# EAGLE design Display (EAGLE 9.6.2)
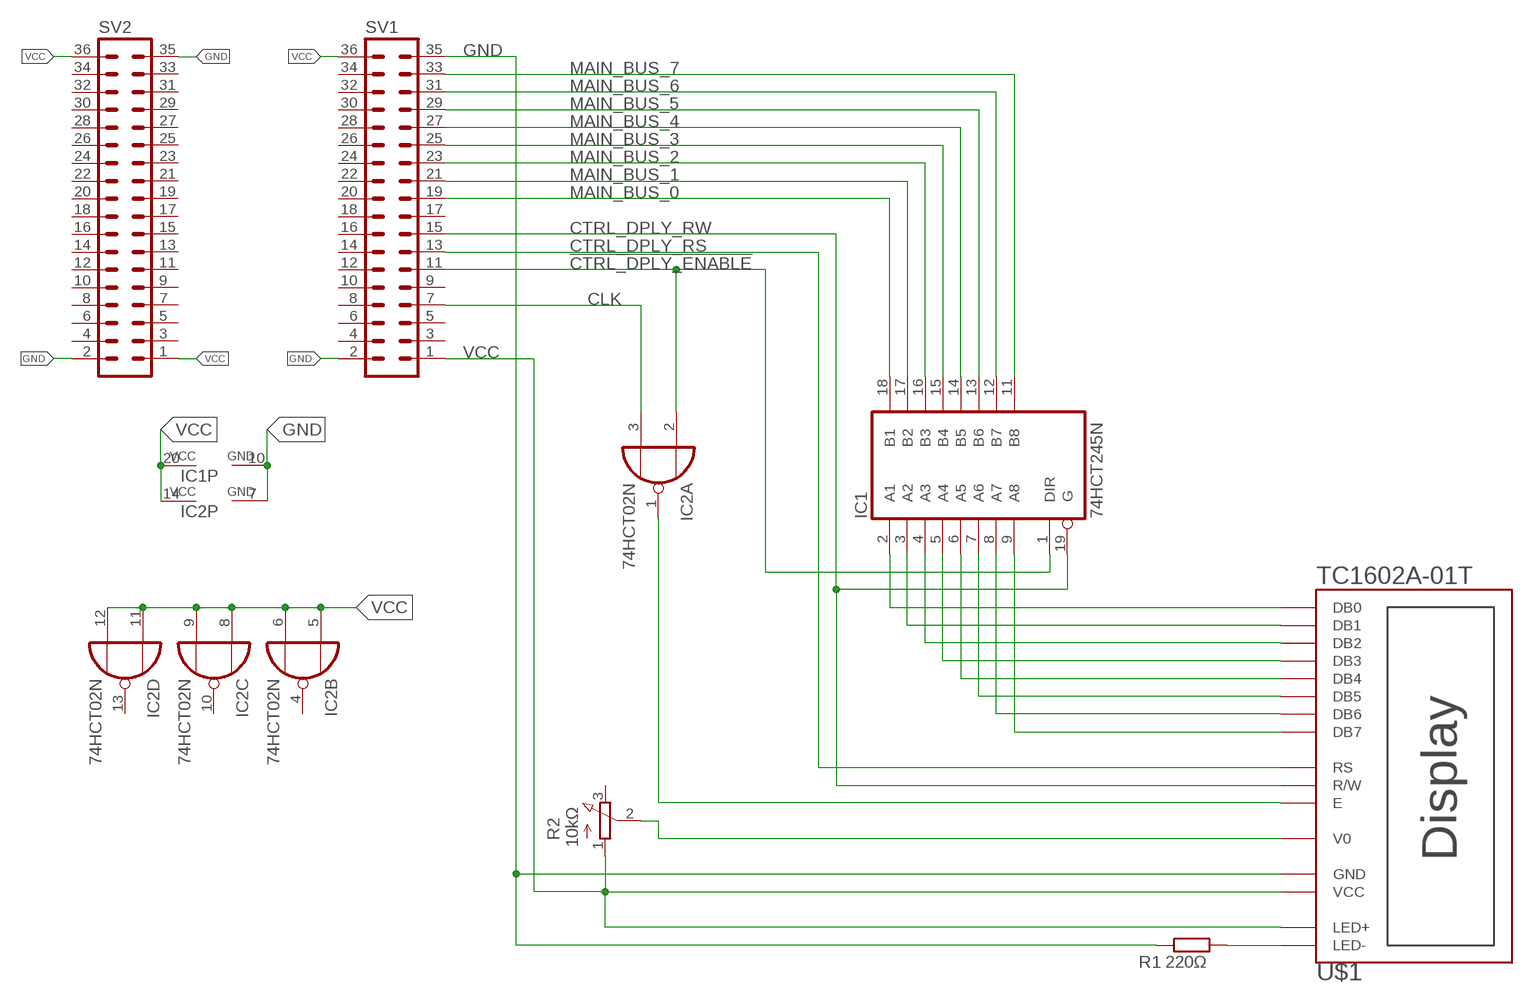
[diagram p0: schematic, sheet 1]

## Parts
IC1  74HCT245N  [DIL20]
IC2  74HCT02N  [DIL14]
R1  220Ω  R-EU_0207/10  [0207/10]
R2  10kΩ  3RP/1610N  [3RP/1610N]
SV1  MA18-2  [MA18-2]
SV2  MA18-2  [MA18-2]
U$1  TC1602A-01T  [TC1602A-01T]

## Nets
!CTRL_DPLY_ENABLE: IC1.1(DIR) IC2.2(A:I0) SV1.11
CLK: IC2.3(A:I1) SV1.7
CTRL_DPLY_RS: SV1.13 U$1.RS
CTRL_DPLY_RW: IC1.19(G) SV1.15 U$1.R/W
GND: IC1.10(GND) IC2.7(P:GND) R1.1 SV1.2 SV1.35 SV2.2 SV2.35 U$1.GND
MAIN_BUS_0: IC1.18(B1) SV1.19
MAIN_BUS_1: IC1.17(B2) SV1.21
MAIN_BUS_2: IC1.16(B3) SV1.23
MAIN_BUS_3: IC1.15(B4) SV1.25
MAIN_BUS_4: IC1.14(B5) SV1.27
MAIN_BUS_5: IC1.13(B6) SV1.29
MAIN_BUS_6: IC1.12(B7) SV1.31
MAIN_BUS_7: IC1.11(B8) SV1.33
N$1: R1.2 U$1.LED-
N$2: R2.2(S) U$1.V0
N$10: IC1.9(A8) U$1.DB7
N$11: IC1.8(A7) U$1.DB6
N$12: IC1.7(A6) U$1.DB5
N$13: IC1.6(A5) U$1.DB4
N$14: IC1.5(A4) U$1.DB3
N$15: IC1.4(A3) U$1.DB2
N$16: IC1.3(A2) U$1.DB1
N$17: IC1.2(A1) U$1.DB0
N$21: IC2.1(A:O) U$1.E
VCC: IC1.20(VCC) IC2.5(B:I0) IC2.6(B:I1) IC2.8(C:I0) IC2.9(C:I1) IC2.11(D:I0) IC2.12(D:I1) IC2.14(P:VCC) R2.1(A) SV1.1 SV1.36 SV2.1 SV2.36 U$1.LED+ U$1.VCC
Unconnected: IC2.4(B:O) IC2.10(C:O) IC2.13(D:O) R2.3(E) SV1.3 SV1.4 SV1.5 SV1.6 SV1.8 SV1.9 SV1.10 SV1.12 SV1.14 SV1.16 SV1.17 SV1.18 SV1.20 SV1.22 SV1.24 SV1.26 SV1.28 SV1.30 SV1.32 SV1.34 SV2.3 SV2.4 SV2.5 SV2.6 SV2.7 SV2.8 SV2.9 SV2.10 SV2.11 SV2.12 SV2.13 SV2.14 SV2.15 SV2.16 SV2.17 SV2.18 SV2.19 SV2.20 SV2.21 SV2.22 SV2.23 SV2.24 SV2.25 SV2.26 SV2.27 SV2.28 SV2.29 SV2.30 SV2.31 SV2.32 SV2.33 SV2.34

## Library data of the parts
IC1 = 74xx-eu:74*245: Octal BUS TRANSCEIVER, 3-state
IC2 = 74xx-eu:74*02: Quad 2-input NOR gate
R1 = rcl:R-EU_: RESISTOR, European symbol; SPICEPREFIX: R
R2 = pot:3RP/1610N: 16mm Potentiometer one level Source: http://www.alphapotentiometers.net/html/16mm_pot_2.html
SV1 SV2 = con-lstb:MA18-2: PIN HEADER; OC_FARNELL: unknown; OC_NEWARK: unknown
U$1 = Dargon's_lib:TC1602A-01T

## Board
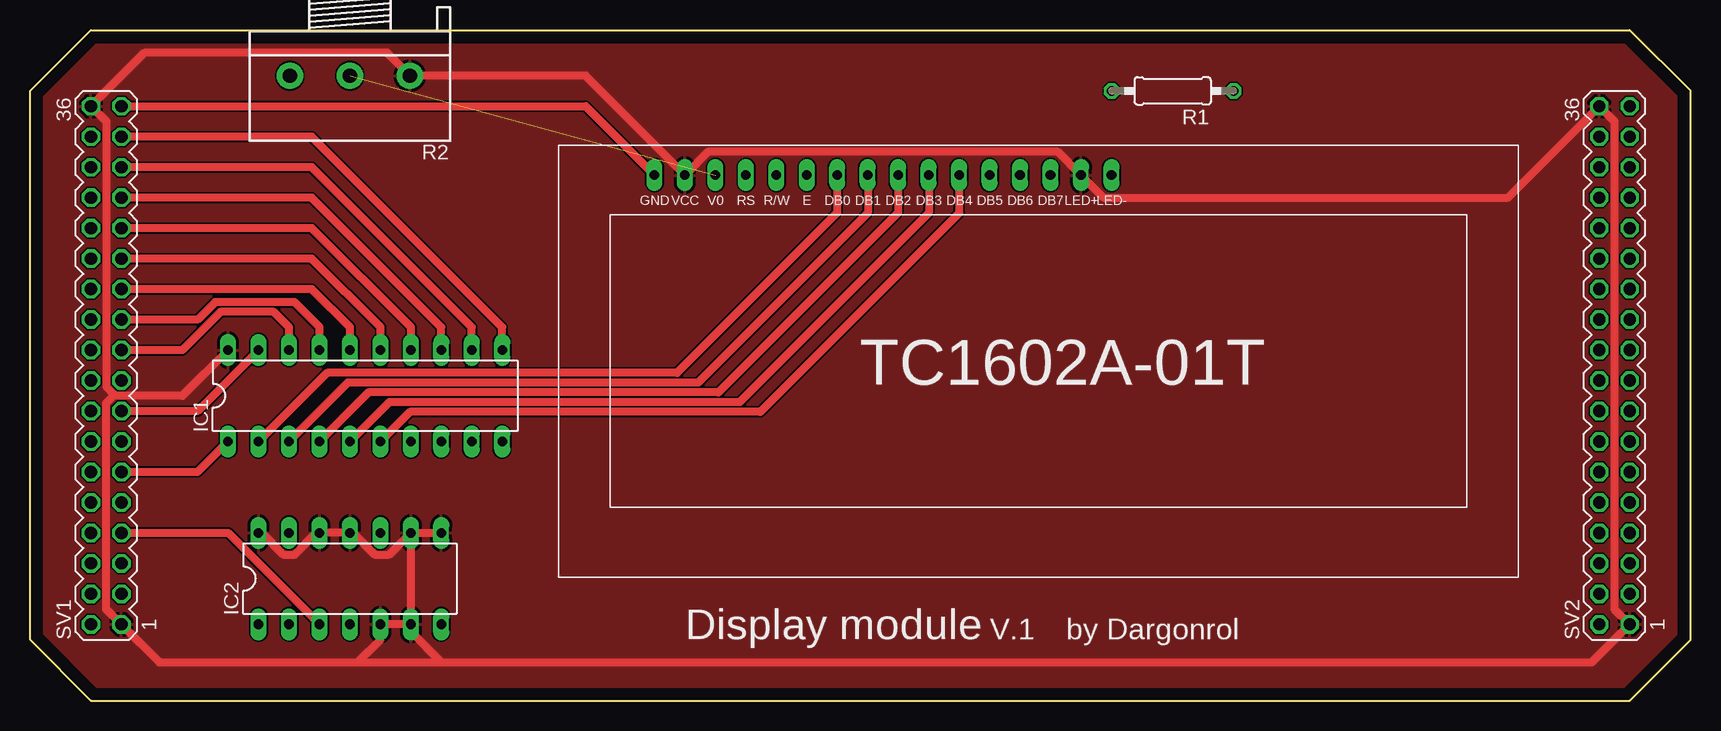
[diagram p1: board, top side]
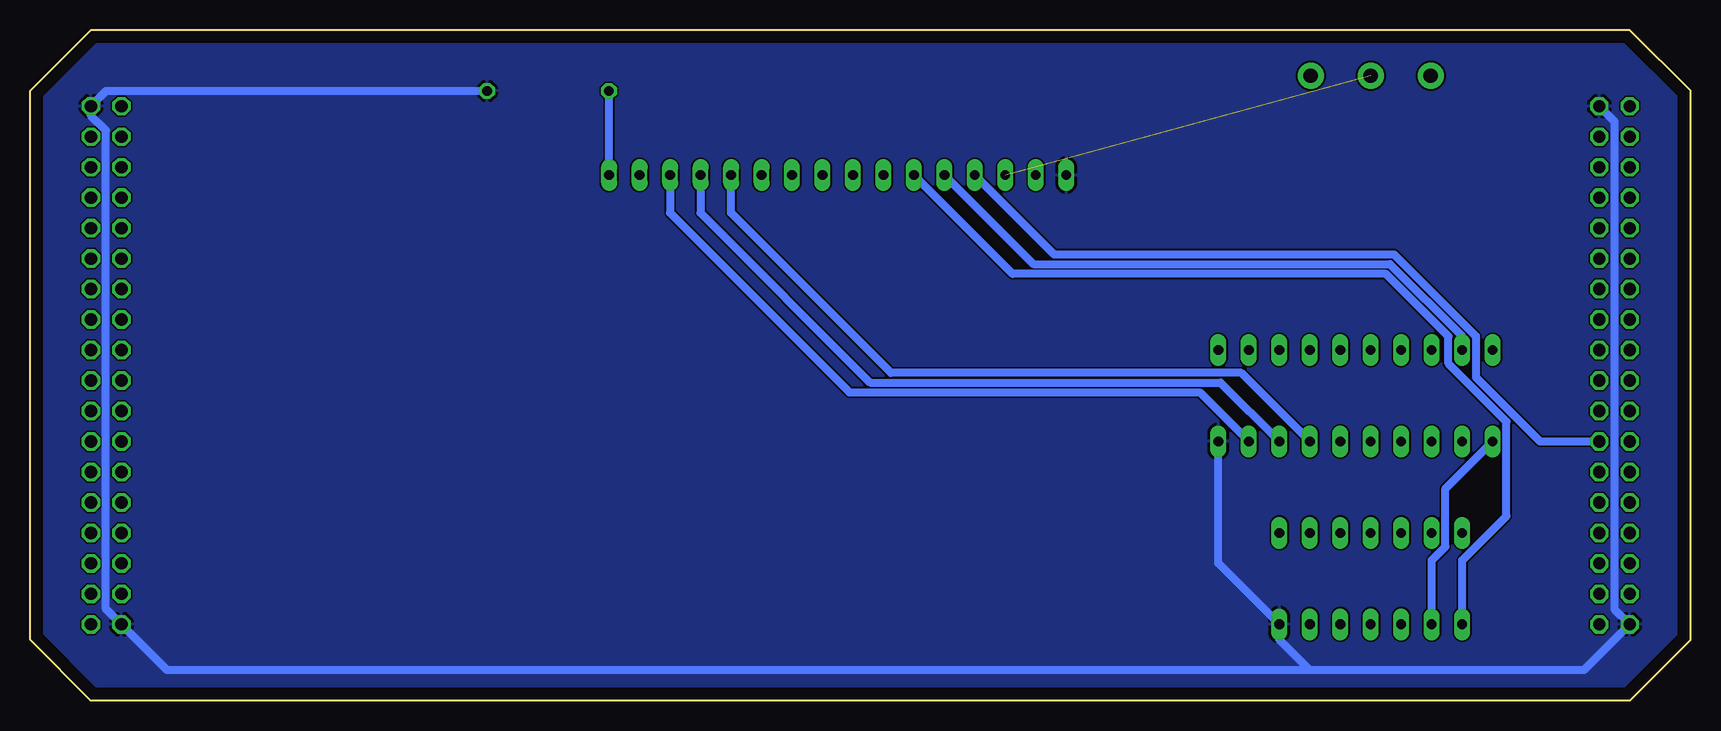
[diagram p2: board, bottom side, seen from below]

Size 138.43 x 55.88 mm. Coordinates in mm from the lower left corner, seen from the top.
Outline: 0,5.08 5.08,0 133.35,0 138.43,5.08 138.43,50.8 133.35,55.88 5.08,55.88 0,50.8 0,5.08
Copper layers (1*16): Top 0.035mm / dielectric 1.5mm / Bottom 0.035mm
Design rules "default *": minimum track width 26mil, minimum drill 0.35mm, track to track 6mil, track to pad 6mil, pad to pad 6mil, via to via 6mil, smd to smd 6mil, copper to edge 40mil, drill to drill 6mil, minimum pad ring 10mil, minimum via ring 8mil, stop-mask expansion 4mil, vias tented up to drill 0mil, thermal gap 10mil

### Footprints (pad centres in the part's own frame; a part is rotated, then mirrored left to right if it is on the bottom)
DIL20 = drill 0.813 long: 1 -11.43,-3.81; 2 -8.89,-3.81; 3 -6.35,-3.81; 4 -3.81,-3.81; 5 -1.27,-3.81; 6 1.27,-3.81; 7 3.81,-3.81; 8 6.35,-3.81; 9 8.89,-3.81; 10 11.43,-3.81; 11 11.43,3.81; 12 8.89,3.81; 13 6.35,3.81; 14 3.81,3.81; 15 1.27,3.81; 16 -1.27,3.81; 17 -3.81,3.81; 18 -6.35,3.81; 19 -8.89,3.81; 20 -11.43,3.81
DIL14 = drill 0.813 long: 1 -7.62,-3.81; 2 -5.08,-3.81; 3 -2.54,-3.81; 4 0,-3.81; 5 2.54,-3.81; 6 5.08,-3.81; 7 7.62,-3.81; 8 7.62,3.81; 9 5.08,3.81; 10 2.54,3.81; 11 0,3.81; 12 -2.54,3.81; 13 -5.08,3.81; 14 -7.62,3.81
0207/10 = drill 0.813 octagon: 1 -5.08,0; 2 5.08,0
3RP/1610N = drill 1.2 pad 2.184: 1 -5,0; 2 0,0; 3 5,0
MA18-2 = drill 1.016 octagon: 1 -21.59,-1.27; 2 -21.59,1.27; 3 -19.05,-1.27; 4 -19.05,1.27; 5 -16.51,-1.27; 6 -16.51,1.27; 7 -13.97,-1.27; 8 -13.97,1.27; 9 -11.43,-1.27; 10 -11.43,1.27; 11 -8.89,-1.27; 12 -8.89,1.27; 13 -6.35,-1.27; 14 -6.35,1.27; 15 -3.81,-1.27; 16 -3.81,1.27; 17 -1.27,-1.27; 18 -1.27,1.27; 19 1.27,-1.27; 20 1.27,1.27; 21 3.81,-1.27; 22 3.81,1.27; 23 6.35,-1.27; 24 6.35,1.27; 25 8.89,-1.27; 26 8.89,1.27; 27 11.43,-1.27; 28 11.43,1.27; 29 13.97,-1.27; 30 13.97,1.27; 31 16.51,-1.27; 32 16.51,1.27; 33 19.05,-1.27; 34 19.05,1.27; 35 21.59,-1.27; 36 21.59,1.27
TC1602A-01T = drill 0.813 long: DB0 15.22,-0.02; DB1 17.76,-0.02; DB2 20.3,-0.02; DB3 22.84,-0.02; DB4 25.38,-0.02; DB5 27.92,-0.02; DB6 30.46,-0.02; DB7 33,-0.02; E 12.68,-0.02; GND -0.02,-0.02; LED+ 35.54,-0.02; LED- 38.08,-0.02; R/W 10.14,-0.02; RS 7.6,-0.02; V0 5.06,-0.02; VCC 2.52,-0.02

### Placement (x,y rotation side)
IC1  27.94,25.4 0 top
IC2  26.67,10.16 0 top
R1  95.25,50.8 180 top
R2  26.67,52.07 180 top
SV1  6.35,27.94 90 top
SV2  132.08,27.94 90 top
U$1  52.07,43.81 0 top

### Tracks (layer width: path | path; a pad name or v marks a point on that pad's centre or on a via)
!CTRL_DPLY_ENABLE
  Top 0.66: SV1.11 13.97,19.05 IC1.1
  Bottom 0.66: IC2.2 21.59,11.69 20.45,12.84 20.45,17.65 IC1.1
CLK
  Top 0.66: SV1.7 16.51,13.97 IC2.3
CTRL_DPLY_RS
  Bottom 0.66: U$1.RS 53.06,37.19 24.73,37.19 17.91,30.37 17.91,26.94 12.56,21.59 SV1.13
CTRL_DPLY_RW
  Top 0.66: IC1.19 13.97,24.13 SV1.15
  Bottom 0.66: U$1.R/W 54.79,36.37 25.06,36.37 19.05,30.36 IC1.19
GND
  Top 0.66: SV1.35 46.31,49.53 U$1.GND
  Bottom 0.66: R1.1 132.08,50.8 SV2.35 133.35,48.75 132.1,47.51 132.1,7.64 SV2.2 127,2.54 31.75,2.54 | 31.75,2.54 8.89,2.54 SV1.2 6.35,7.62 6.35,48.26 SV1.35 | 31.75,2.54 34.29,5.08 IC2.7 39.37,11.43 IC1.10
  pour Bottom: -5.08,51.44 2.54,59.05 133.35,59.05 141.6,50.8 141.6,3.81 135.25,-2.54 2.54,-2.54 -3.81,3.81 -5.08,5.08
MAIN_BUS_0
  Top 0.66: IC1.18 21.59,31.11 20.32,32.38 15.88,32.38 12.7,29.21 SV1.19
MAIN_BUS_1
  Top 0.66: IC1.17 24.13,31.11 22.05,33.2 15.42,33.2 13.97,31.75 SV1.21
MAIN_BUS_2
  Top 0.66: IC1.16 26.67,31.11 23.5,34.29 SV1.23
MAIN_BUS_3
  Top 0.66: IC1.15 29.21,31.11 23.5,36.83 SV1.25
MAIN_BUS_4
  Top 0.66: IC1.14 31.75,31.11 23.5,39.37 SV1.27
MAIN_BUS_5
  Top 0.66: IC1.13 34.29,31.11 23.5,41.91 SV1.29
MAIN_BUS_6
  Top 0.66: IC1.12 36.83,31.11 23.5,44.45 SV1.31
MAIN_BUS_7
  Top 0.66: IC1.11 39.37,31.11 23.5,46.99 SV1.33
N$1
  Bottom 0.66: U$1.LED- 90.15,50.78 R1.2
N$2  (1 unrouted)
N$10
  Bottom 0.66: U$1.DB7 85.09,43.77 85.09,40.64 70.13,25.68 40.92,25.68 IC1.9
N$11
  Bottom 0.66: U$1.DB6 82.55,43.77 82.55,40.64 68.4,26.49 39.19,26.49 IC1.8
N$12
  Bottom 0.66: IC1.7 37.47,27.3 66.67,27.3 80.01,40.64 80.01,43.77 U$1.DB5
N$13
  Top 0.66: U$1.DB4 77.45,40.66 77.47,40.64 60.88,24.05 31.67,24.05 IC1.6
N$14
  Top 0.66: U$1.DB3 74.93,43.77 74.93,40.64 59.16,24.87 29.95,24.87 IC1.5
N$15
  Top 0.66: U$1.DB2 72.37,40.66 57.39,25.68 28.22,25.68 IC1.4
N$16
  Top 0.66: U$1.DB1 69.85,43.77 69.85,40.64 55.7,26.49 26.49,26.49 IC1.3
N$17
  Top 0.66: U$1.DB0 67.29,40.66 53.98,27.34 53.98,27.3 24.77,27.3 IC1.2
N$21
  Bottom 0.66: IC2.1 19.05,11.69 15.37,15.38 15.37,23.25 20.19,28.08 20.19,30.35 25.4,35.56 56.52,35.56 U$1.E
VCC
  Top 0.66: IC2.6 IC2.5 29.21,5.08 27.3,3.17 | IC2.6 IC2.9 | IC2.9 IC2.8 | IC2.14 19.31,13.97 21.12,12.17 22.06,12.17 23.87,13.97 IC2.12 IC2.11 26.93,13.97 28.74,12.17 29.95,12.17 IC2.9 | 27.3,3.17 10.79,3.17 SV1.1 6.35,7.62 6.35,24.77 6.99,25.4 | 27.3,3.17 34.29,3.17 | 34.29,3.17 130.18,3.17 SV2.1 132.08,7.62 132.08,48.26 SV2.36 123.19,41.91 89.5,41.91 U$1.LED+ 85.69,45.72 56.52,45.72 U$1.VCC 46.31,52.07 R2.1 29.84,53.9 29.84,53.98 9.53,53.98 SV1.36 6.38,48.23 6.38,26.15 6.99,25.55 6.99,25.4 | IC2.6 31.75,5.71 34.29,3.17 | IC1.20 12.7,25.4 6.99,25.4
  pour Top: -5.08,51.44 2.54,59.05 133.35,59.05 141.6,50.8 141.6,3.81 135.25,-2.54 2.54,-2.54 -5.08,5.08

### Text on the board
tPlace: Display module | V.1 | by Dargonrol